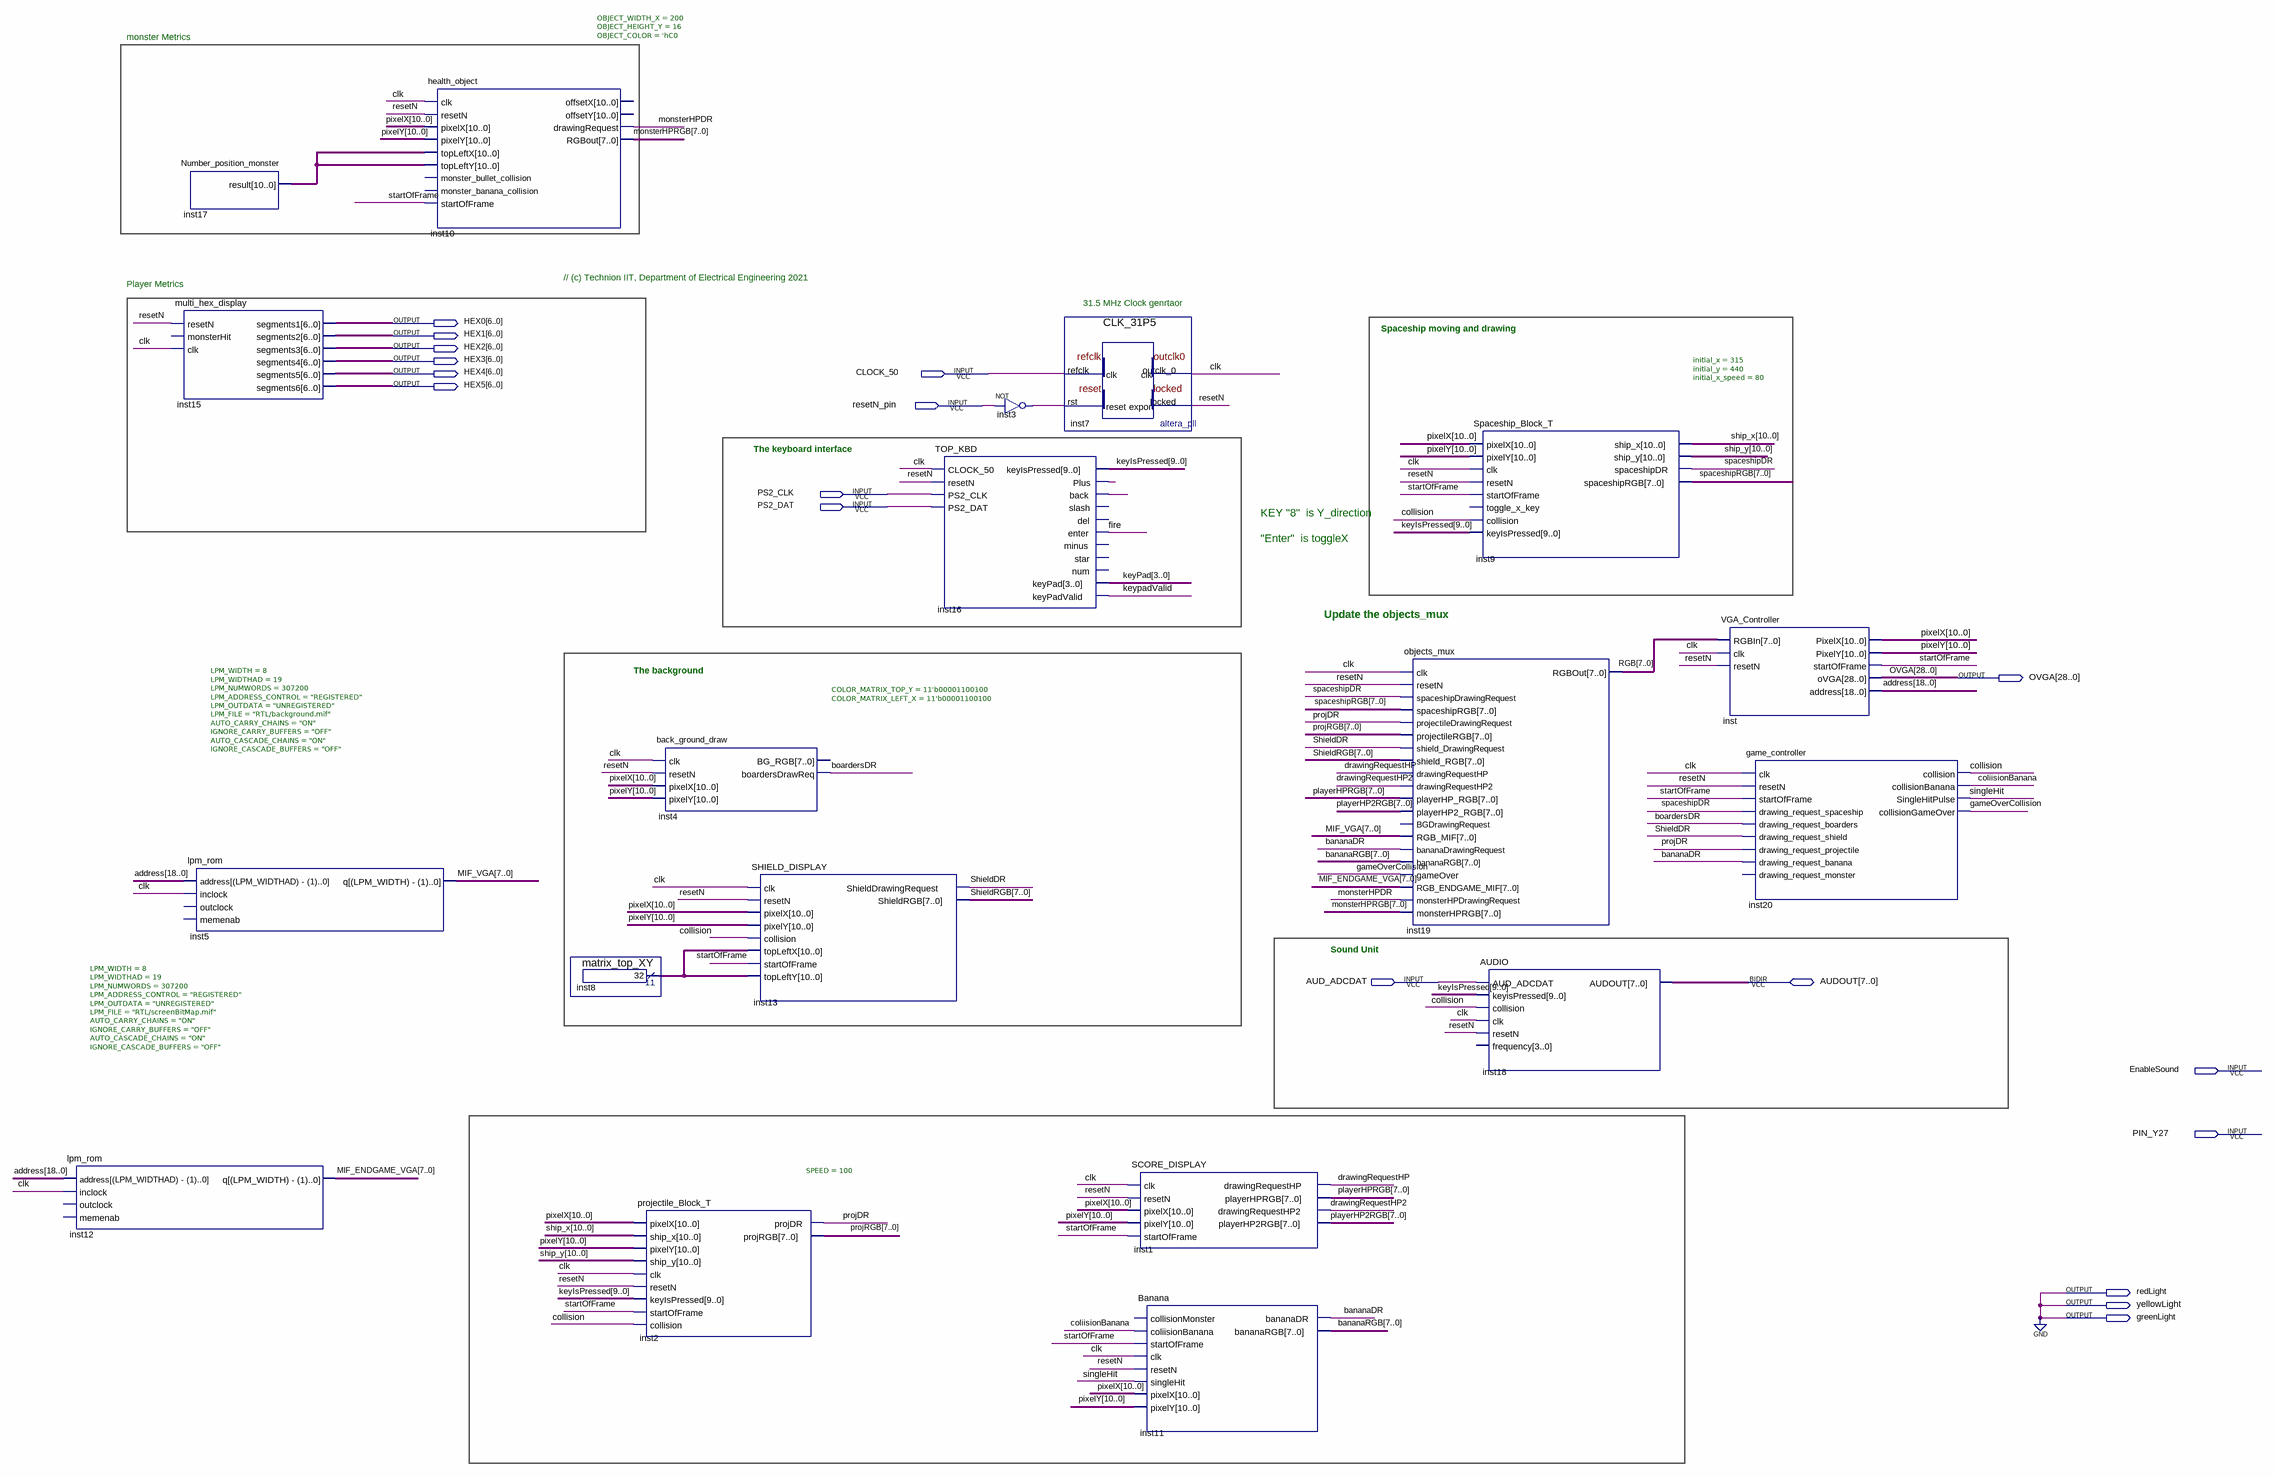
[diagram p0: schematic sheet]
// Quartus schematic TOP_VGA_DEMO_KBD.bdf as structural Verilog: 19 symbols, 18 pins
module TOP_VGA_DEMO_KBD (
  input  CLOCK_50,
  input  resetN_pin,
  input  PS2_CLK,
  input  PS2_DAT,
  input  AUD_ADCDAT,
  input  EnableSound,
  input  PIN_Y27,
  inout  [7:0] AUDOUT,
  output [6:0] HEX0,
  output [6:0] HEX1,
  output [6:0] HEX2,
  output [6:0] HEX3,
  output [6:0] HEX4,
  output [6:0] HEX5,
  output [28:0] OVGA,
  output redLight,
  output yellowLight,
  output greenLight
);

  wire bananaDR, boardersDR, clk, coliisionBanana, collision, drawingRequestHP, drawingRequestHP2, fire,
       gameOverCollision, inst3_out, inst16_back, inst16_plus, keypadValid, monsterHPDR, projDR, resetN,
       ShieldDR, singleHit, spaceshipDR, startOfFrame;
  wire [3:0] keyPad;
  wire [7:0] bananaRGB, MIF_ENDGAME_VGA, MIF_VGA, monsterHPRGB, playerHP2RGB, playerHPRGB, projRGB, RGB,
       ShieldRGB, spaceshipRGB;
  wire [9:0] keyIsPressed;
  wire [10:0] inst8_result, inst17_result, pixelX, pixelY, ship_x, ship_y;
  wire [18:0] address;

  lpm_rom #(.LPM_WIDTH(8), .LPM_WIDTHAD(19), .LPM_NUMWORDS(307200), .LPM_ADDRESS_CONTROL("REGISTERED"), .LPM_OUTDATA("UNREGISTERED"), .LPM_FILE("RTL/screenBitMap.mif"), .AUTO_CARRY_CHAINS("ON"), .IGNORE_CARRY_BUFFERS("OFF"), .AUTO_CASCADE_CHAINS("ON"), .IGNORE_CASCADE_BUFFERS("OFF")) inst12 (
    .address(address), .inclock(clk), .q(MIF_ENDGAME_VGA));  // open: outclock, memenab
  Number_position_monster inst17 (.result(inst17_result));
  multi_hex_display inst15 (
    .resetN(resetN), .clk(clk), .segments1(HEX0), .segments2(HEX1), .segments3(HEX2), .segments4(HEX3),
    .segments5(HEX4), .segments6(HEX5));  // open: monsterHit
  lpm_rom #(.LPM_WIDTH(8), .LPM_WIDTHAD(19), .LPM_NUMWORDS(307200), .LPM_ADDRESS_CONTROL("REGISTERED"), .LPM_OUTDATA("UNREGISTERED"), .LPM_FILE("RTL/background.mif"), .AUTO_CARRY_CHAINS("ON"), .IGNORE_CARRY_BUFFERS("OFF"), .AUTO_CASCADE_CHAINS("ON"), .IGNORE_CASCADE_BUFFERS("OFF")) inst5 (
    .address(address), .inclock(clk), .q(MIF_VGA));  // open: outclock, memenab
  health_object #(.OBJECT_WIDTH_X(200), .OBJECT_HEIGHT_Y(16), .OBJECT_COLOR('hC0)) inst10 (
    .clk(clk), .resetN(resetN), .pixelX(pixelX), .pixelY(pixelY), .topLeftX(inst17_result),
    .topLeftY(inst17_result), .startOfFrame(startOfFrame), .drawingRequest(monsterHPDR), .RGBout(monsterHPRGB));  // open: monster_bullet_collision, monster_banana_collision, offsetX, offsetY
  matrix_top_XY inst8 (.result(inst8_result));
  back_ground_draw #(.COLOR_MATRIX_TOP_Y(11'b00001100100), .COLOR_MATRIX_LEFT_X(11'b00001100100)) inst4 (
    .clk(clk), .resetN(resetN), .pixelX(pixelX), .pixelY(pixelY), .boardersDrawReq(boardersDR));  // open: BG_RGB
  projectile_Block_T #(.SPEED(100)) inst2 (
    .pixelX(pixelX), .ship_x(ship_x), .pixelY(pixelY), .ship_y(ship_y), .clk(clk), .resetN(resetN),
    .keyIsPressed(keyIsPressed), .startOfFrame(startOfFrame), .collision(collision), .projDR(projDR),
    .projRGB(projRGB));
  SHIELD_DISPLAY inst13 (
    .clk(clk), .resetN(resetN), .pixelX(pixelX), .pixelY(pixelY), .collision(collision),
    .topLeftX(inst8_result), .startOfFrame(startOfFrame), .topLeftY(inst8_result),
    .ShieldDrawingRequest(ShieldDR), .ShieldRGB(ShieldRGB));
  TOP_KBD inst16 (
    .CLOCK_50(clk), .resetN(resetN), .PS2_CLK(PS2_CLK), .PS2_DAT(PS2_DAT), .keyIsPressed(keyIsPressed),
    .Plus(inst16_plus), .back(inst16_back), .enter(fire), .keyPad(keyPad), .keyPadValid(keypadValid));  // open: slash, del, minus, star, num
  not inst3 (inst3_out, resetN_pin);
  CLK_31P5 inst7 (.refclk(CLOCK_50), .rst(inst3_out), .outclk_0(clk), .locked(resetN));
  SCORE_DISPLAY inst1 (
    .clk(clk), .resetN(resetN), .pixelX(pixelX), .pixelY(pixelY), .startOfFrame(startOfFrame),
    .drawingRequestHP(drawingRequestHP), .playerHPRGB(playerHPRGB), .drawingRequestHP2(drawingRequestHP2),
    .playerHP2RGB(playerHP2RGB));
  Banana inst11 (
    .coliisionBanana(coliisionBanana), .startOfFrame(startOfFrame), .clk(clk), .resetN(resetN),
    .singleHit(singleHit), .pixelX(pixelX), .pixelY(pixelY), .bananaDR(bananaDR), .bananaRGB(bananaRGB));  // open: collisionMonster
  objects_mux inst19 (
    .clk(clk), .resetN(resetN), .spaceshipDrawingRequest(spaceshipDR), .spaceshipRGB(spaceshipRGB),
    .projectileDrawingRequest(projDR), .projectileRGB(projRGB), .shield_DrawingRequest(ShieldDR),
    .shield_RGB(ShieldRGB), .drawingRequestHP(drawingRequestHP), .drawingRequestHP2(drawingRequestHP2),
    .playerHP_RGB(playerHPRGB), .playerHP2_RGB(playerHP2RGB), .RGB_MIF(MIF_VGA),
    .bananaDrawingRequest(bananaDR), .bananaRGB(bananaRGB), .gameOver(gameOverCollision),
    .RGB_ENDGAME_MIF(MIF_ENDGAME_VGA), .monsterHPDrawingRequest(monsterHPDR), .monsterHPRGB(monsterHPRGB),
    .RGBOut(RGB));  // open: BGDrawingRequest
  Spaceship_Block_T #(.initial_x(315), .initial_y(440), .initial_x_speed(80)) inst9 (
    .pixelX(pixelX), .pixelY(pixelY), .clk(clk), .resetN(resetN), .startOfFrame(startOfFrame),
    .collision(collision), .keyIsPressed(keyIsPressed), .ship_x(ship_x), .ship_y(ship_y),
    .spaceshipDR(spaceshipDR), .spaceshipRGB(spaceshipRGB));  // open: toggle_x_key
  AUDIO inst18 (
    .AUD_ADCDAT(AUD_ADCDAT), .keyisPressed(keyIsPressed), .collision(collision), .clk(clk), .resetN(resetN),
    .AUDOUT(AUDOUT));  // open: frequency
  VGA_Controller inst (
    .RGBIn(RGB), .clk(clk), .resetN(resetN), .PixelX(pixelX), .PixelY(pixelY), .startOfFrame(startOfFrame),
    .oVGA(OVGA), .address(address));
  game_controller inst20 (
    .clk(clk), .resetN(resetN), .startOfFrame(startOfFrame), .drawing_request_spaceship(spaceshipDR),
    .drawing_request_boarders(boardersDR), .drawing_request_shield(ShieldDR),
    .drawing_request_projectile(projDR), .drawing_request_banana(bananaDR), .collision(collision),
    .collisionBanana(coliisionBanana), .SingleHitPulse(singleHit), .collisionGameOver(gameOverCollision));  // open: drawing_request_monster

  assign greenLight = 1'b0;
  assign redLight = 1'b0;
  assign yellowLight = 1'b0;

  // Notes on the sheet:
  //   monster Metrics
  //   // (c) Technion IIT, Department of Electrical Engineering 2021
  //   Player Metrics
  //   31.5 MHz Clock genrtaor
  //   Spaceship moving and drawing
  //   The keyboard interface
  //   KEY "8"  is Y_direction
  //   "Enter"  is toggleX
  //   Update the objects_mux
  //   The background
  //   Sound Unit
endmodule
